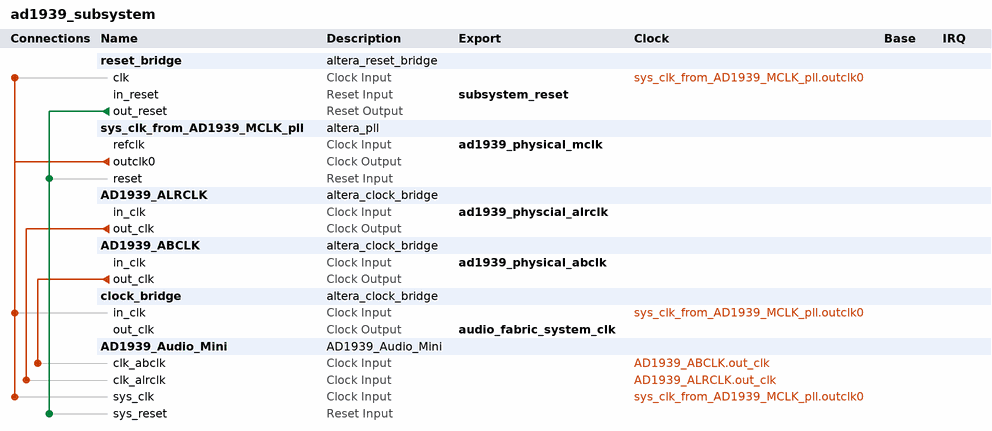
[diagram p0: system contents]
# Platform Designer (Qsys) system ad1939_subsystem, Cyclone V 5CSEBA6U23I7
# Parameters at their usual value, and those the tool derives, are not listed.
package require -exact qsys 21.1
create_system ad1939_subsystem
set_project_property DEVICE_FAMILY {Cyclone V}
set_project_property DEVICE 5CSEBA6U23I7

add_instance reset_bridge altera_reset_bridge 21.1
set_instance_parameter_value reset_bridge ACTIVE_LOW_RESET 0
set_instance_parameter_value reset_bridge SYNCHRONOUS_EDGES deassert

add_instance sys_clk_from_AD1939_MCLK_pll altera_pll 21.1
set_instance_parameter_value sys_clk_from_AD1939_MCLK_pll gui_device_speed_grade 2
set_instance_parameter_value sys_clk_from_AD1939_MCLK_pll gui_number_of_clocks 1
set_instance_parameter_value sys_clk_from_AD1939_MCLK_pll gui_operation_mode direct
set_instance_parameter_value sys_clk_from_AD1939_MCLK_pll gui_output_clock_frequency0 98.304
set_instance_parameter_value sys_clk_from_AD1939_MCLK_pll gui_pll_mode {Integer-N PLL}
set_instance_parameter_value sys_clk_from_AD1939_MCLK_pll gui_reference_clock_frequency 12.288
set_instance_parameter_value sys_clk_from_AD1939_MCLK_pll gui_use_locked false

add_instance AD1939_ALRCLK altera_clock_bridge 21.1
set_instance_parameter_value AD1939_ALRCLK DERIVED_CLOCK_RATE 0
set_instance_parameter_value AD1939_ALRCLK EXPLICIT_CLOCK_RATE 192000

add_instance AD1939_ABCLK altera_clock_bridge 21.1
set_instance_parameter_value AD1939_ABCLK DERIVED_CLOCK_RATE 0
set_instance_parameter_value AD1939_ABCLK EXPLICIT_CLOCK_RATE 12288000

add_instance clock_bridge altera_clock_bridge 21.1
set_instance_parameter_value clock_bridge DERIVED_CLOCK_RATE 98304000
set_instance_parameter_value clock_bridge EXPLICIT_CLOCK_RATE 0

add_instance AD1939_Audio_Mini AD1939_Audio_Mini 1.0

# connections
add_connection AD1939_ABCLK.out_clk AD1939_Audio_Mini.clk_abclk clock
add_connection AD1939_ALRCLK.out_clk AD1939_Audio_Mini.clk_alrclk clock
add_connection sys_clk_from_AD1939_MCLK_pll.outclk0 AD1939_Audio_Mini.sys_clk clock
add_connection sys_clk_from_AD1939_MCLK_pll.outclk0 clock_bridge.in_clk clock
add_connection sys_clk_from_AD1939_MCLK_pll.outclk0 reset_bridge.clk clock
add_connection reset_bridge.out_reset AD1939_Audio_Mini.sys_reset reset
add_connection reset_bridge.out_reset sys_clk_from_AD1939_MCLK_pll.reset reset

# exported interfaces
add_interface ad1939_physcial_alrclk clock sink
set_interface_property ad1939_physcial_alrclk EXPORT_OF AD1939_ALRCLK.in_clk
add_interface ad1939_physical_abclk clock sink
set_interface_property ad1939_physical_abclk EXPORT_OF AD1939_ABCLK.in_clk
add_interface ad1939_physical_mclk clock sink
set_interface_property ad1939_physical_mclk EXPORT_OF sys_clk_from_AD1939_MCLK_pll.refclk
add_interface audio_fabric_system_clk clock source
set_interface_property audio_fabric_system_clk EXPORT_OF clock_bridge.out_clk
add_interface subsystem_reset reset sink
set_interface_property subsystem_reset EXPORT_OF reset_bridge.in_reset

set_interconnect_requirement {$system} qsys_mm.clockCrossingAdapter HANDSHAKE
set_interconnect_requirement {$system} qsys_mm.maxAdditionalLatency 1

save_system ad1939_subsystem.qsys
